# EAGLE design LED_Series (EAGLE 7.1.0)
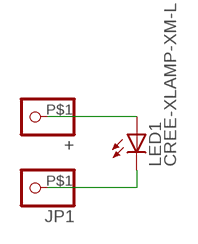
[diagram p0: schematic, sheet 1]

## Parts
+  PINHD-1X1  [1X01]
JP1  PINHD-1X1  [1X01]
LED1  CREE-XLAMP-XM-L  [CREE-XLAMP-XM-L]

## Nets
AN: JP1.P$1 LED1.C LED1.C@1(C)
CAT: +.P$1 LED1.A LED1.A@1(A)

## Library data of the parts
+ JP1 = evan:PINHD-1X1: PIN HEADER
LED1 = led:CREE-XLAMP-XM-L: Cree® XLamp® XM-L LEDs Source: http://www.cree.com

## Board
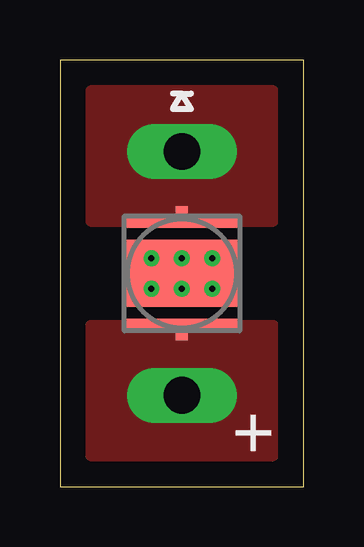
[diagram p1: board, top side]
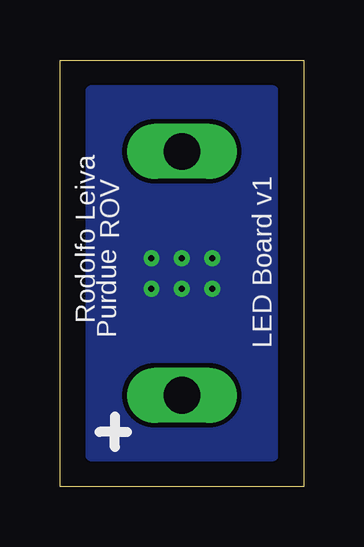
[diagram p2: board, bottom side, seen from below]

Size 10.16 x 17.78 mm. Coordinates in mm from the lower left corner, seen from the top.
Outline: 10.16,17.78 0,17.78 0,0 10.16,0 10.16,17.78
Copper layers (1*16): Top 0.035mm / dielectric 1.5mm / Bottom 0.035mm
Design rules "default": minimum track width 10mil, minimum drill 24mil, track to track 8mil, track to pad 8mil, pad to pad 8mil, via to via 8mil, smd to smd 8mil, copper to edge 40mil, drill to drill 8mil, minimum pad ring 10mil, minimum via ring 8mil, stop-mask expansion 4mil, vias tented up to drill 0mil, thermal gap 10mil

### Footprints (pad centres in the part's own frame; a part is rotated, then mirrored left to right if it is on the bottom)
1X01 = drill 1.524 pad 1.676 long: P$1 0,0
CREE-XLAMP-XM-L = smd 0.5 x 4.8: A 2.141,0; C -2.141,0 | smd 0.5 x 0.5: A@1 2.54,0; C@1 -2.54,0 | smd 2.782 x 4.8: EXP 0,0

### Placement (x,y rotation side)
+  5.08,3.81 0 top
JP1  5.08,13.97 0 top
LED1  5.08,8.89 270 top

### Tracks (layer width: path | path; a pad name or v marks a point on that pad's centre or on a via)
AN
  pour Top (no thermals): 8.89,11.05 8.89,16.51 1.27,16.51 1.27,11.05
CAT
  pour Top (no thermals): 8.89,1.27 8.89,6.73 1.27,6.73 1.27,1.27
SINK  (via drill 0.25)
  other vias: 3.81,9.52 5.08,9.52 6.35,9.52 6.35,8.25 5.08,8.25 3.81,8.25
  pour Bottom: 1.27,16.51 8.89,16.51 8.89,1.27 1.27,1.27

### Text on the board
_bsilk: LED Board v1 | Rodolfo Leiva | ROV | Purdue